# Altium schematic sheet Master.SchDoc
size A4
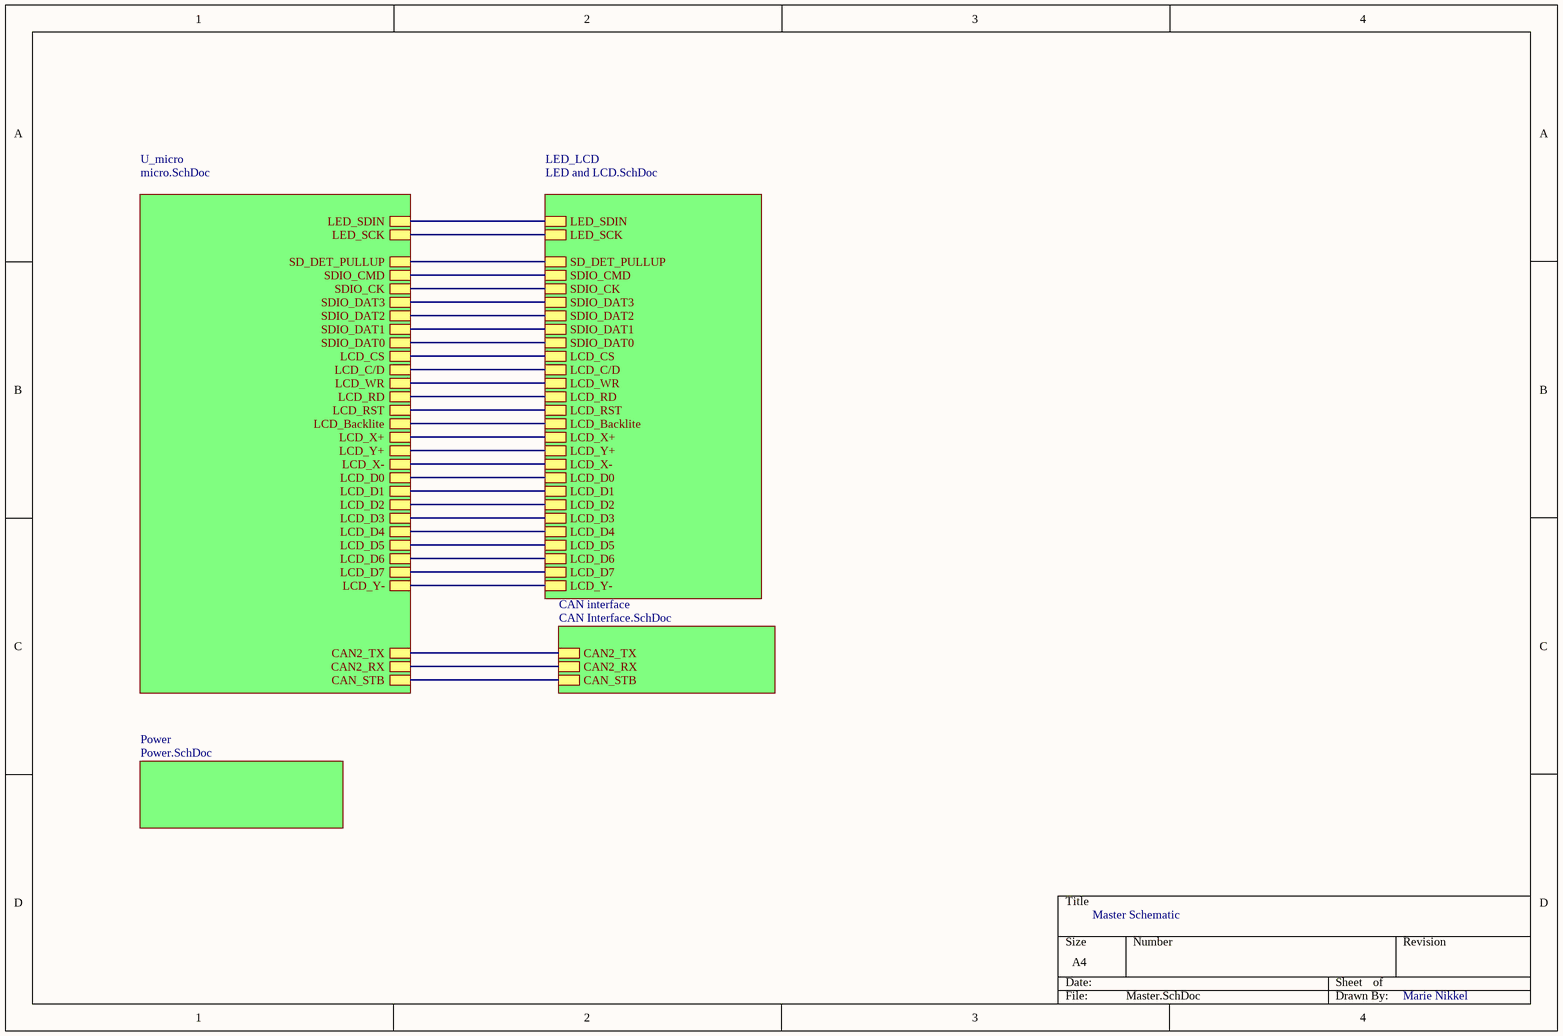
[diagram p0: Master.SchDoc]

## Sub-sheets
CAN interface = CAN Interface.SchDoc: CAN2_TX, CAN2_RX, CAN_STB
LED_LCD = LED and LCD.SchDoc: LCD_C/D, LCD_WR, LCD_RD, LCD_RST, LCD_CS, LCD_Backlite, LCD_D0, LCD_D1, LCD_D2, LCD_D3, LCD_D4, LCD_D5, LCD_D7, LCD_D6, SDIO_DAT0, SDIO_DAT1, SDIO_DAT2, SDIO_DAT3, SDIO_CK, SDIO_CMD, LED_SDIN, SD_DET_PULLUP, LCD_X+, LCD_Y+, LCD_X-, LCD_Y-, LED_SCK
Power = Power.SchDoc: no entries
U_micro = micro.SchDoc: LCD_CS, LCD_C/D, LCD_WR, LCD_RD, LCD_RST, LCD_Backlite, LCD_X+, LCD_Y+, LCD_X-, LCD_D0, LCD_D1, LCD_D2, LCD_D3, LCD_D4, LCD_D5, LCD_D6, LCD_D7, CAN2_TX, CAN2_RX, SDIO_DAT0, SDIO_DAT2, SDIO_DAT1, SDIO_DAT3, SDIO_CK, SDIO_CMD, CAN_STB, SD_DET_PULLUP, LED_SDIN, LED_SCK, LCD_Y-

## Nets
(unnamed): sheet U_micro/LCD_CS, sheet LED_LCD/LCD_CS
(unnamed): sheet U_micro/LCD_C/D, sheet LED_LCD/LCD_C/D
(unnamed): sheet U_micro/LCD_WR, sheet LED_LCD/LCD_WR
(unnamed): sheet U_micro/LCD_RD, sheet LED_LCD/LCD_RD
(unnamed): sheet U_micro/LCD_RST, sheet LED_LCD/LCD_RST
(unnamed): sheet U_micro/LCD_Backlite, sheet LED_LCD/LCD_Backlite
(unnamed): sheet U_micro/LCD_X+, sheet LED_LCD/LCD_X+
(unnamed): sheet U_micro/LCD_Y+, sheet LED_LCD/LCD_Y+
(unnamed): sheet U_micro/LCD_X-, sheet LED_LCD/LCD_X-
(unnamed): sheet U_micro/LCD_D0, sheet LED_LCD/LCD_D0
(unnamed): sheet U_micro/LCD_D1, sheet LED_LCD/LCD_D1
(unnamed): sheet U_micro/LCD_D2, sheet LED_LCD/LCD_D2
(unnamed): sheet U_micro/LCD_D3, sheet LED_LCD/LCD_D3
(unnamed): sheet U_micro/LCD_D4, sheet LED_LCD/LCD_D4
(unnamed): sheet U_micro/LCD_D5, sheet LED_LCD/LCD_D5
(unnamed): sheet U_micro/LCD_D6, sheet LED_LCD/LCD_D6
(unnamed): sheet U_micro/LCD_D7, sheet LED_LCD/LCD_D7
(unnamed): sheet U_micro/CAN2_TX, sheet CAN interface/CAN2_TX
(unnamed): sheet U_micro/CAN2_RX, sheet CAN interface/CAN2_RX
(unnamed): sheet U_micro/SDIO_DAT0, sheet LED_LCD/SDIO_DAT0
(unnamed): sheet U_micro/SDIO_DAT2, sheet LED_LCD/SDIO_DAT2
(unnamed): sheet U_micro/SDIO_DAT1, sheet LED_LCD/SDIO_DAT1
(unnamed): sheet U_micro/SDIO_DAT3, sheet LED_LCD/SDIO_DAT3
(unnamed): sheet U_micro/SDIO_CK, sheet LED_LCD/SDIO_CK
(unnamed): sheet U_micro/SDIO_CMD, sheet LED_LCD/SDIO_CMD
(unnamed): sheet U_micro/CAN_STB, sheet CAN interface/CAN_STB
(unnamed): sheet U_micro/SD_DET_PULLUP, sheet LED_LCD/SD_DET_PULLUP
(unnamed): sheet U_micro/LED_SDIN, sheet LED_LCD/LED_SDIN
(unnamed): sheet U_micro/LED_SCK, sheet LED_LCD/LED_SCK
(unnamed): sheet U_micro/LCD_Y-, sheet LED_LCD/LCD_Y-

## Notes on the sheet
- Master Schematic
- Marie Nikkel